# Altium schematic sheet Telemetria.SchDoc
size A4
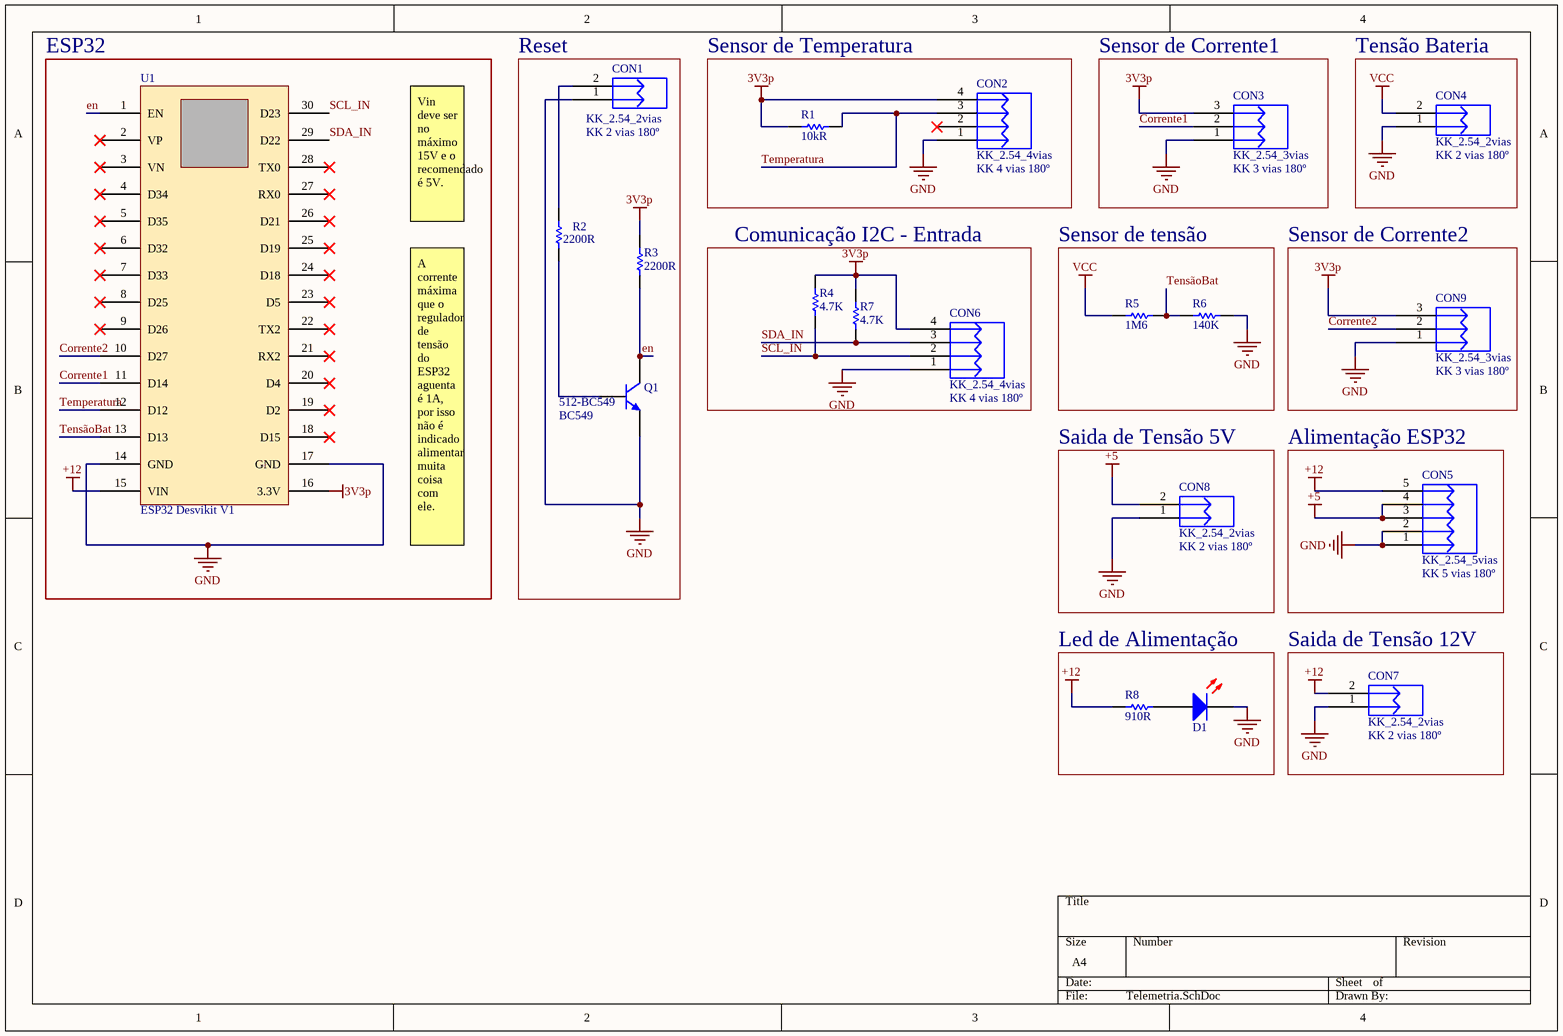
[diagram p0: Telemetria.SchDoc]

## Parts
CON1  KK_2.54_2vias  Valor: KK 2 vias 180º  [KK_2VIAS_180º]
CON2  KK_2.54_4vias  Valor: KK 4 vias 180º  [KK_4vias_180°]
CON3  KK_2.54_3vias  Valor: KK 3 vias 180º  [KK_3vias_180º]
CON4  KK_2.54_2vias  Valor: KK 2 vias 180º  [KK_2VIAS_180º]
CON5  KK_2.54_5vias  Valor: KK 5 vias 180º  [KK_5vias_180°]
CON6  KK_2.54_4vias  Valor: KK 4 vias 180º  [KK_4vias_180°]
CON7  KK_2.54_2vias  Valor: KK 2 vias 180º  [KK_2VIAS_180º]
CON8  KK_2.54_2vias  Valor: KK 2 vias 180º  [KK_2VIAS_180º]
CON9  KK_2.54_3vias  Valor: KK 3 vias 180º  [KK_3vias_180º]
D1  LED 5MM RED  [LED 5MM RED]  (value not drawn)
Q1  BC549  Supplier Part Number 1: 512-BC549  [TO92]
R1  Resistance (Ohms): 10kR  [RES 470R 1/4W CARBON FILM]  (hidden comment: RES 470R 1/4W CARBON FILM)
R2  Resistance (Ohms): 2200R  [RES 470R 1/4W CARBON FILM]  (hidden comment: RES 470R 1/4W CARBON FILM)
R3  Resistance (Ohms): 2200R  [RES 470R 1/4W CARBON FILM]  (hidden comment: RES 470R 1/4W CARBON FILM)
R4  4.7K  [RES 4.7K 1/4W CARBON FILM]
R5  1M6  [RESISTOR 0603]
R6  140K  [RESISTOR 0805]
R7  4.7K  [RES 4.7K 1/4W CARBON FILM]
R8  Resistance (Ohms): 910R  [RES 470R 1/4W CARBON FILM]  (hidden comment: RES 470R 1/4W CARBON FILM)
U1  value ESP32 Desvikit V1  [ESP32_Desvikit_v1]  (hidden comment: microcontrolador)

## Blocks framed on the sheet
ESP32: U1
Reset: CON1 Q1 R2 R3
Sensor de Temperatura: CON2 R1
Sensor de Corrente1: CON3
Tensão Bateria: CON4
Comunicação I2C - Entrada: CON6 R4 R7
Sensor de tensão: R5 R6
Sensor de Corrente2: CON9
Saida de Tensão 5V: CON8
Alimentação ESP32: CON5
Led de Alimentação: D1 R8
Saida de Tensão 12V: CON7

## Nets
3V3p: CON2.4 CON3.3 CON6.4 CON9.3 R1.1 R3.2 R4.1 R7.1 U1.16(3.3V)
+5: CON5.3 CON5.4 CON8.2
+12: CON5.5 CON7.2 R8.2 U1.15(VIN)
GND: CON1.1 CON2.1 CON3.1 CON4.1 CON5.1 CON5.2 CON6.1 CON7.1 CON8.1 CON9.1 D1.2(K) Q1.3(E) R6.2 U1.14(GND) U1.17(GND)
VCC: CON4.2 R5.1
Corrente1: CON3.2 U1.11(D14)
Corrente2: CON9.2 U1.10(D27)
en: Q1.1(C) R3.1 U1.1(EN)
SCL_IN: CON6.2 R4.2 U1.30(D23)
SDA_IN: CON6.3 R7.2 U1.29(D22)
Temperatura: CON2.3 R1.2 U1.12(D12)
TensãoBat: R5.2 R6.1 U1.13(D13)
NetCON1_2: CON1.2 R2.2
NetD1_1: D1.1(A) R8.1
NetQ1_2: Q1.2(B) R2.1

Not connected (* = marked no-connect by the designer): CON2 2*; U1 2(VP)* 3(VN)* 4(D34)* 5(D35)* 6(D32)* 7(D33)* 8(D25)* 9(D26)* 18(D15)* 19(D2)* 20(D4)* 21(RX2)* 22(TX2)* 23(D5)* 24(D18)* 25(D19)* 26(D21)* 27(RX0)* 28(TX0)*

## Notes on the sheet
- Vin deve ser no máximo 15V e o recomendado é 5V.
- A corrente máxima que o regulador de tensão do  ESP32 aguenta é 1A, por isso não é indicado alimentar muita coisa com ele.

## Library data of the parts
CON1 CON4 CON7 CON8 = KK_2.54_2vias: Conector KK 2.54mm 2 vias; Descrição: Conector KK 3 vias com passo 2.54mm; Encapsulamento: PTH - 180º; Modelo: 2 vias - 180º; Marca: *; Observação: *
CON2 CON6 = KK_2.54_4vias: Conector KK 2.54mm 4 vias; Descrição: Conector KK 3 vias com passo 2.54mm; Encapsulamento: PTH - 180º; Modelo: 3 vias - 180º; Marca: *; Observação: *
CON3 CON9 = KK_2.54_3vias: Conector KK 2.54mm 3 vias; Descrição: Conector KK 3 vias com passo 2.54mm; Encapsulamento: PTH - 180º; Modelo: 3 vias - 180º; Marca: *; Observação: *
CON5 = KK_2.54_5vias: Conector KK 2.54mm 5 vias; Descrição: Conector KK 3 vias com passo 2.54mm; Encapsulamento: PTH - 180º; Modelo: 3 vias - 180º; Marca: *; Observação: *
D1 = LED 5MM RED: Manufacturer: Paralight; Manufacturer Part Number: IMP585; Bulb Size: 3mm; Wavelength Typ: 625; Forward Voltage: 2; Forward Current If: 20; Luminous Intensity: 3; LED Mounting: Through Hole; Lens Shape: Round; Viewing Angle: 60°; SVHC: No SVHC (15-Jun-2015); External Diameter: 2.9; External Length / Height: 4.6; Forward Voltage VF Max: 2.5; LED / Lamp Size: 3mm / T-1; LED Type: Standard; Lead Cross-section Depth: 0.5; Luminous Intensity @ If Min: 0.7; PIV Max: 5; Peak Forward Current: 7; Voltage Vf Typ: 2.2V<!--FANDB--><div class="features-and-benefits-container"><div class="features-and-benefits-description"><span class="features-benefits-value">The L-934LID from Kingbright is a through hole round shape high efficiency red colour LED. The device is made of gallium arsenide phosphide on gallium phosphide orange light emitting diode. This LED is widely used because of low power consumption, long life and solid state reliability.</span></div><div class="features-and-benefits-list"><ul class="features-and-benefits-list-list"><li class="features-and-benefits-list-item">Standard bulb size of T-1 (3mm)</li><li class="features-and-benefits-list-item">Reliable and rugged</li><li class="features-and-benefits-list-item">Viewing angle is 60°</li><li class="features-and-benefits-list-item">Luminous intensity of 3mcd at 2mA</li><li class="features-and-benefits-list-item">Forward voltage is 2.0V</li><li class="features-and-benefits-list-item">Forward current (If) is 20mA</li><li class="features-and-benefits-list-item">Dominant wavelength is 625nm at IF=20mA</li><li class="features-and-benefits-list-item">Peak wavelength is 627nm at IF=20; Supplier 1: Mult Comercial; RoHS: YES; Stock 1: 35260; Pricing 1: 1=0.15 (BRL); LED Colour: Red; Packaging: Each; MSL: -; Current If Luminous Intensity: 2; Dominant Wavelength: 625; Forward Current If Max: 20; Lead Cross-section Width: 0.5; Lead Spacing: 2.54; Luminous Intensity Typ: 3; Mounting Type: PCB Through Hole; No. of Pins: 2; Operating Temperature Max: 85; Operating Temperature Min: -40; Operating Temperature Range: -40°C to +85; Peak Wavelength: 625; ComponentLink1URL: http://loja.multcomercial.com.br/led-3mm-vermelho-difuso-l-314hd-paralight.html; ComponentLink1Description: http://loja.multcomercial.com.br/led-3mm-vermelho-difuso-l-314hd-paralight.html; Supplier Part Number 1: Led 3mm Vermelho Difuso L-314HD - Paralight
Q1 = BC549: TRANS NPN 30V 0.1A TO-92; Manufacturer: Fairchild Semiconductor; Configuration: Single; Emitter- Base Voltage VEBO: 5 V; Collector-Emitter Saturation Voltage: 200 mV; Gain Bandwidth Product fT: 300 MHz; DC Collector/Base Gain hfe Min: 110; DC Current Gain hFE Max: 800; Maximum Power Dissipation: 0.5 W; Supplier 1: Mouser; Manufacturer Part Number: BC549; Product Category: Bipolar Transistors - BJT; RoHS: Details; Transistor Polarity: NPN; Collector- Base Voltage VCBO: 30 V; Collector- Emitter Voltage VCEO Max: 30 V; Maximum DC Collector Current: 0.1 A; Maximum Operating Temperature: + 150 C; Mounting Style: Through Hole; Package / Case: TO-92-3; Brand: Fairchild Semiconductor; Minimum Operating Temperature: - 65 C; Packaging: Bulk; Series: BC549; Factory Pack Quantity: 2000; ComponentLink1URL: https://datasheet.ciiva.com/982/bc546-982130.pdf; ComponentLink1Description: https://datasheet.ciiva.com/982/bc546-982130.pdf; ComponentLink2URL: https://datasheet.ciiva.com/17179/bc549-17179663.pdf; ComponentLink2Description: https://datasheet.ciiva.com/17179/bc549-17179663.pdf
R1-R3 R8 = RES 470R 1/4W CARBON FILM: RES 470R OHM 1/4W 5% CARBON FILM; Manufacturer: Ty-Ohm; Manufacturer Part Number: CR25; Power (Watts): 0.25W, 1/4W; Temperature Coefficient: 0/ -500ppm/°C; Supplier 1: Mult Comercial; RoHS: RoHS Compliant; Category: Resistors; Stock 1: 617543; Pricing 1: 1=0.20 (BRL); Packaging: Cut Tape (CT); Tolerance: ±5%; Composition: Carbon Film; Features: Flame Retardant Coating, Safety; Operating Temperature: -55°C ~ 155°C; Package / Case: Axial; Supplier Device Package: Axial; Size / Dimension: 0.091" Dia x 0.256" L (2.30mm x 6.50mm); Height: -; Number of Terminations: 2; ComponentLink1URL: http://loja.multcomercial.com.br/resistor-de-1-4-de-watt-cr25-5-de-tolerancia.html; ComponentLink1Description: http://loja.multcomercial.com.br/resistor-de-1-4-de-watt-cr25-5-de-tolerancia.html; Supplier Part Number 1: Resistor de Filme de Carbono 1/4 de Watt CR25 5% de tolerância - 0.22R Ω à 10M Ω
R4 R7 = RES 4.7K 1/4W CARBON FILM: RES 4.7K OHM 1/4W 5% CARBON FILM; Manufacturer: Ty-Ohm; Manufacturer Part Number: CR25; Power (Watts): 0.25W, 1/4W; Temperature Coefficient: 0/ -500ppm/°C; Supplier 1: Mult Comercial; RoHS: RoHS Compliant; Category: Resistors; Stock 1: 617543; Pricing 1: 1=0.20 (BRL); Packaging: Cut Tape (CT); Tolerance: ±5%; Composition: Carbon Film; Features: Flame Retardant Coating, Safety; Operating Temperature: -55°C ~ 155°C; Package / Case: Axial; Supplier Device Package: Axial; Size / Dimension: 0.091" Dia x 0.256" L (2.30mm x 6.50mm); Height: -; Number of Terminations: 2; ComponentLink1URL: http://loja.multcomercial.com.br/resistor-de-1-4-de-watt-cr25-5-de-tolerancia.html; ComponentLink1Description: http://loja.multcomercial.com.br/resistor-de-1-4-de-watt-cr25-5-de-tolerancia.html; Supplier Part Number 1: Resistor de Filme de Carbono 1/4 de Watt CR25 5% de tolerância - 0.22R Ω à 10M Ω; Resistance (Ohms): ?
R5 = RES 0R 5% 0603: Manufacturer: PANASONIC ELECTRONIC COMPONENTS; Manufacturer Part Number: ERJ-3GEY0R00V; Product Range: AEC-Q200 ERJ3; Resistance: 0; Power Rating: 100; Voltage Rating: 75; Resistor Case Style: 0603 [1608 Metric]; Resistance (Ohms): 0.0; Tolerance: Jumper; Power (Watts): 0.1W, 1/10W; Brand: Panasonic; Qualification: AEC-Q200; RoHS: YES; Resistance Tolerance: -; Packaging: Cut Tape; MSL: -; ComponentLink1URL: http://www.farnell.com/cad/1697908.zip; ComponentLink1Description: http://www.farnell.com/cad/1697908.zip; ComponentLink2URL: http://www.farnell.com/datasheets/1678796.pdf; ComponentLink2Description: http://www.farnell.com/datasheets/1678796.pdf; Category: Resistors; Composition: Thick Film; Features: Automotive AEC-Q200; Temperature Coefficient: -; Operating Temperature: -55°C ~ 155°C; Package / Case: 0603 (1608 Metric); Supplier Device Package: 0603; Size / Dimension: 0.063" L x 0.031" W (1.60mm x 0.80mm); Height: 0.022" (0.55mm); Number of Terminations: 2; ComponentLink3URL: http://industrial.panasonic.com/www-cgi/jvcr13pz.cgi?E+PZ+3+AOA0001+ERJ3GEY0R00V+7+WW; ComponentLink3Description: http://industrial.panasonic.com/www-cgi/jvcr13pz.cgi?E+PZ+3+AOA0001+ERJ3GEY0R00V+7+WW; Supplier 1: Mouser; Stock 1: 1987085; Pricing 1: 1=0.160, 10=0.019, 100=0.013, 500=0.010, 1000=0.005, 5000=0.003 (AUD); Length: 1.6 mm; Operating Temperature Range: - 55 C to + 155 C; Product: Thick Film Resistors Zero-Ohm; Series: ERJ; Termination Style: SMD/SMT; Type: Thick Film Resistors SMD; Width: 0.8 mm; Case Code - in: 0603; Case Code - mm: 1608; RoHS - Mouser: E; Minimum Order Quantity: 1; Reeling: True; ComponentLink4URL: http://www.mouser.com/ds/2/315/AOA0000C84-947596.pdf; ComponentLink4Description: http://www.mouser.com/ds/2/315/AOA0000C84-947596.pdf; Supplier Part Number 1: 667-ERJ-3GEY0R00V
R6 = RES 220R 0805: Manufacturer: Panasonic; Manufacturer Part Number: ERJP06F2200V; Supplier 1: Allied; RoHS: No; Stock 1: 0; Pricing 1: 50=0.0376, 125=0.0339, 250=0.0308, 500=0.0282 (USD); ComponentLink1URL: http://www.alliedelec.com/m/d/0ad461061842af8edcaf7ac114212a8c.pdf; ComponentLink1Description: http://www.alliedelec.com/m/d/0ad461061842af8edcaf7ac114212a8c.pdf; ComponentLink2URL: http://www.alliedelec.com/panasonic-erjp06f2200v/70348978/; ComponentLink2Description: http://www.alliedelec.com/panasonic-erjp06f2200v/70348978/
U1 = ESP32 Desvikit v1: microcontrolador com moculo bluethoth e wifi